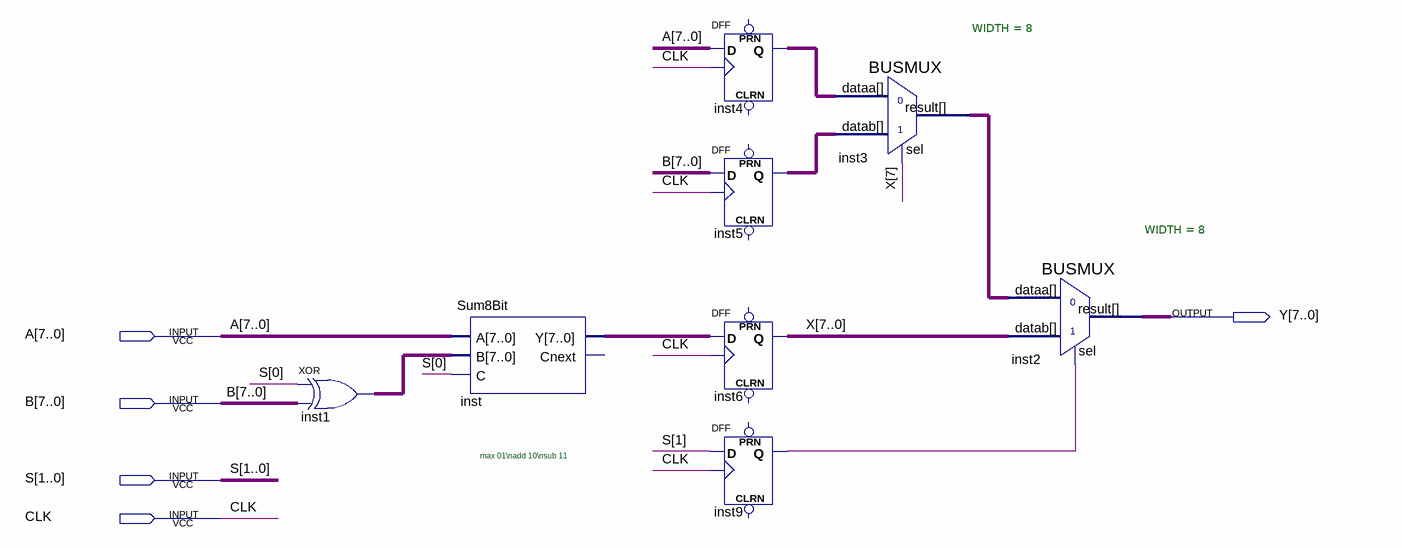
[diagram p0: schematic sheet]
// Quartus schematic AU2.bdf as structural Verilog: 8 symbols, 5 pins
module AU2 (
  input  [7:0] A,
  input  [7:0] B,
  input  [1:0] S,
  input  CLK,
  output [7:0] Y
);

  wire inst9_q;
  wire [7:0] inst1_out, inst3_result, inst4_q, inst5_q, inst_y, X;

  assign inst1_out = {8{S[0]}} ^ B;  // XOR inst1, 8 bits wide
  Sum8Bit inst (.A(A), .B(inst1_out), .C(S[0]), .Y(inst_y));  // open: Cnext
  DFF inst4[7:0] (.CLK(CLK), .D(A), .Q(inst4_q));  // open: CLRN, PRN
  DFF inst5[7:0] (.CLK(CLK), .D(B), .Q(inst5_q));  // open: CLRN, PRN
  DFF inst6[7:0] (.CLK(CLK), .D(inst_y), .Q(X));  // open: CLRN, PRN
  DFF inst9 (.CLK(CLK), .D(S[1]), .Q(inst9_q));  // open: CLRN, PRN
  BUSMUX #(.WIDTH(8)) inst3 (.datab(inst5_q), .sel(X[7]), .dataa(inst4_q), .result(inst3_result));
  BUSMUX #(.WIDTH(8)) inst2 (.datab(X), .sel(inst9_q), .dataa(inst3_result), .result(Y));

  // Notes on the sheet:
  //   max 01\nadd 10\nsub 11
endmodule
